# EAGLE design cherry-u2f (EAGLE 8.3.0)
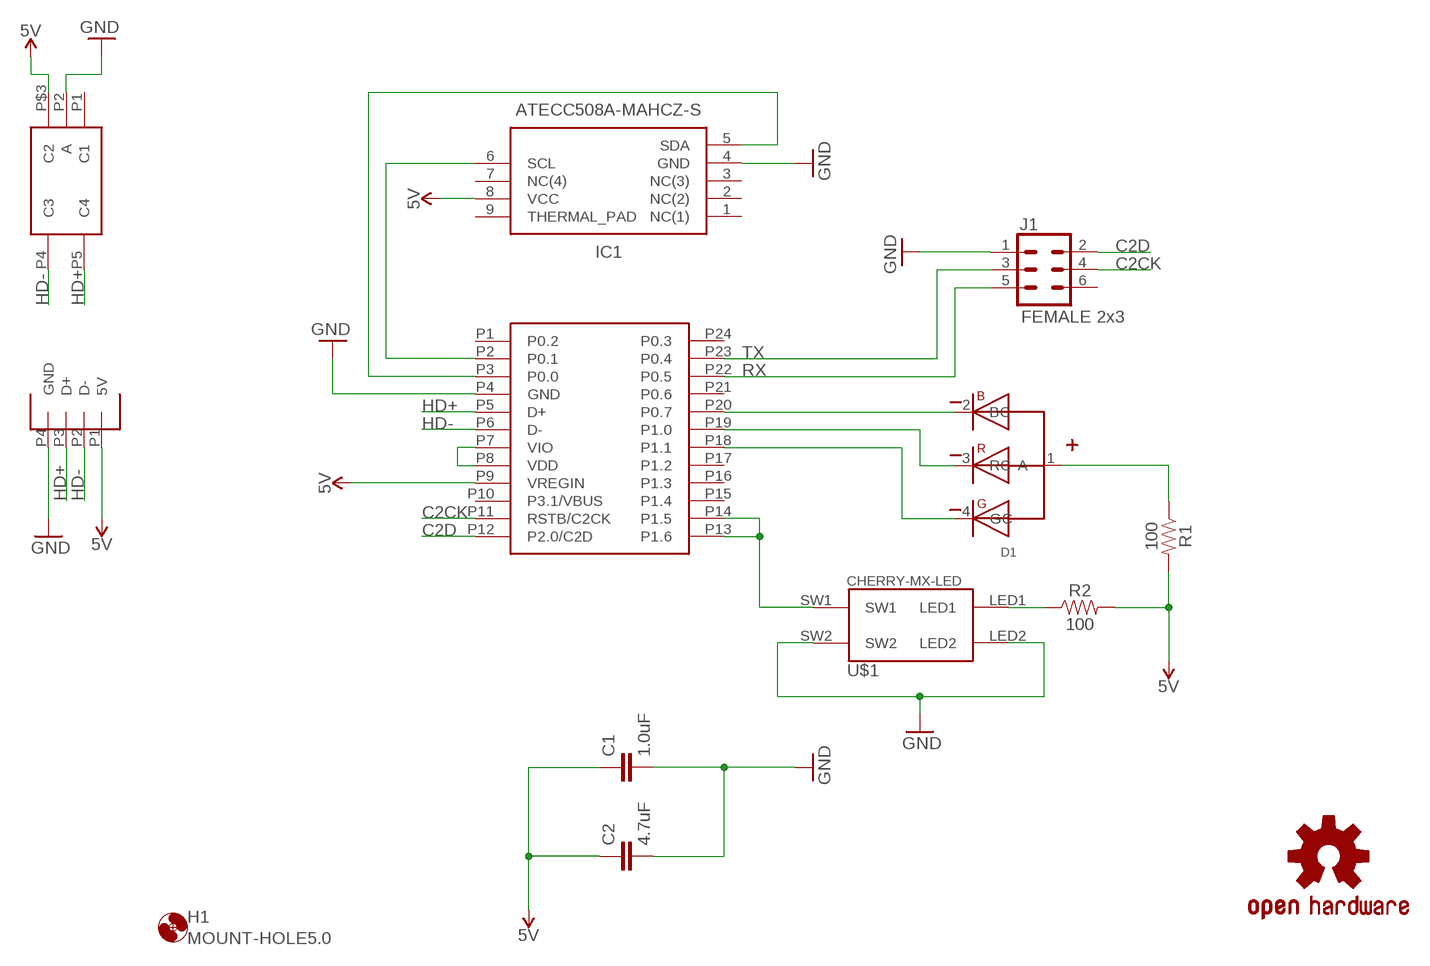
[diagram p0: schematic, sheet 1]

## Parts
C1  1.0uF  1.0UF-0603-16V-10%  [0603]
C2  4.7uF  4.7UF0603  [0603]
D1  WL-SFTW-150141M173100-R&G&B  [WL-SFTW_3528]
H1  MOUNT-HOLE5.0  [5,0]
IC1  ATECC508A-MAHCZ-S  [SON50P300X200X60-9N]
J1  FEMALE 2x3  CONN_03X2FEMALE  [2X3]
LOGO1  OSHW-LOGOS  [OSHW-LOGO-S]
R1  100  100OHM-0603-1/4W-5%  [0603]
R2  100  100OHM-0603-1/4W-5%  [0603]
U$1  CHERRY-MX-LED  [CHERRY-MX-LED]
U$2  EFM8UB1-QSOP24  [QSOP24]
U$3  DF5A5.6JE  [DF5A5.6JE]
U$4  USB-A-PCB  [USB-A-PCB]

## Nets
5V: C1.1 C2.1 IC1.8(VCC) R1.2 R2.2 U$2.P9(VREGIN) U$3.P$3(C2) U$4.P1(5V)
C2CK: J1.4 U$2.P11(RSTB/C2CK)
C2D: J1.2 U$2.P12(P2.0/C2D)
GND: C1.2 C2.2 IC1.4(GND) J1.1 U$1.LED2 U$1.SW2 U$2.P4(GND) U$3.P2(A) U$4.P4(GND)
HD+: U$2.P5(D+) U$3.P5(C4) U$4.P3(D+)
HD-: U$2.P6(D-) U$3.P4(C3) U$4.P2(D-)
N$1: U$1.SW1 U$2.P13(P1.6) U$2.P14(P1.5)
N$2: U$2.P7(VIO) U$2.P8(VDD)
N$3: R2.1 U$1.LED1
N$4: D1.3(RC) U$2.P19(P1.0)
N$5: D1.1(A) R1.1
N$6: D1.2(BC) U$2.P20(P0.7)
N$7: D1.4(GC) U$2.P18(P1.1)
N$10: IC1.6(SCL) U$2.P2(P0.1)
N$11: IC1.5(SDA) U$2.P3(P0.0)
RX: J1.5 U$2.P22(P0.5)
TX: J1.3 U$2.P23(P0.4)
Unconnected: IC1.1(NC(1)) IC1.2(NC(2)) IC1.3(NC(3)) IC1.7(NC(4)) IC1.9(THERMAL_PAD) J1.6 U$2.P1(P0.2) U$2.P10(P3.1/VBUS) U$2.P15(P1.4) U$2.P16(P1.3) U$2.P17(P1.2) U$2.P21(P0.6) U$2.P24(P0.3) U$3.P1(C1)

## Library data of the parts
C1 = SparkFun-Capacitors:1.0UF: 1µF ceramic capacitors A capacitor is a passive two-terminal electrical component used to store electrical energy temporarily in an electric field.; PROD_ID: CAP-00868
C2 = SparkFun-Capacitors:4.7UF: 4.7µF ceramic capacitors A capacitor is a passive two-terminal electrical component used to store electrical energy temporarily in an electric field.; PROD_ID: CAP-08280
D1 = Wurth_Elektronik_Optoelectronics_rev17b:WL-SFTW: SMD full-color TOP LED Characteristics Low energy consumption High reliability Low current requirement Fast switching No UV/IR radiation High brightness RGB individual control Compact package outline Black surface Applications Flash light Switch indicators Equipments indicators Accent and decorative lighting Electronic signage Video displays Backlight for LCDs, PDAs and TVs Oven, microwave Street lighting Ideal for lateral coupling in light guides <http://katalog.we-online.de/media/images/eipal/WL-SFTW_pf2.jpg> Details see: http://katalog.we-online.de/en/led/WL-SFTW?m Updated 2015-04-10 2015 (C) Wurth Elektronik
H1 = holes:MOUNT-HOLE: MOUNTING HOLE with drill center marker
IC1 = ATECC508A-MAHCZ-S:ATECC508A-MAHCZ-S: Security ICs / Authentication ICs AWS IOT Provisioned ECC508A 10Kb - 8ld UDFN Generic SWI, 3K T&R <https://componentsearchengine.com/Images/1/ATECC508A-MAHCZ-S.jpg> Source: Datasheet <http://www.mouser.com/ds/2/268/Atmel-8923S-CryptoAuth-ATECC508A-Datasheet-Summary-1065793.pdf>; DESCRIPTION: Security ICs / Authentication ICs AWS IOT Provisioned ECC508A 10Kb - 8ld UDFN Generic SWI, 3K T&R; HEIGHT: 0.6mm; MANUFACTURER_NAME: Atmel; MANUFACTURER_PART_NUMBER: ATECC508A-MAHCZ-S; SUPPLIER_NAME: RS
J1 = SparkFun-Connectors:CONN_03X2: Multi connection point. Often used as Generic Header-pin footprint for 0.1 inch spaced/style header connections You can populate with any combo of single row headers, but if you'd like an exact match, check these: Header - 2x3 (Male, 0.1") <https://www.sparkfun.com/products/12807> (PRT-12807) Header - 2x3 (Female, 0.1") <https://www.sparkfun.com/products/13010> (PRT-13010) 2x3 Pin Shrouded Header <https://www.sparkfun.com/products/10877> (PRT-10877) On any of the 0.1 inch spaced packages, you can populate with these: Break Away Headers - Straight <https://www.sparkfun.com/products/116> (PRT-00116) Break Away Male Headers - Right Angle <https://www.sparkfun.com/products/553> (PRT-00553) Female Headers <https://www.sparkfun.com/products/115> (PRT-00115) Break Away Headers - Machine Pin <https://www.sparkfun.com/products/117> (PRT-00117) Break Away Female Headers - Swiss Machine Pin <https://www.sparkfun.com/products/743> (PRT-00743) Special note: the shrouded connector mates well with our 3x2 ribbon cables: Ribbon Crimp Connector - 6-pin (2x3, Female) <https://www.sparkfun.com/products/10651> (PRT-10651) Ribbon Cable - 6 wire (15ft) <https://www.sparkfun.com/products/10646> (PRT-10646); PROD_ID: CONN-11566
LOGO1 = SparkFun-Aesthetics:OSHW-LOGO: Open-Source Hardware (OSHW) Logo This logo indicates the piece of hardware it is found on incorporates a OSHW license and/or adheres to the definition of open source hardware found here: http://freedomdefined.org/OSHW
R1 R2 = SparkFun-Resistors:100OHM: 100Ω resistor A resistor is a passive two-terminal electrical component that implements electrical resistance as a circuit element. Resistors act to reduce current flow, and, at the same time, act to lower voltage levels within circuits. - Wikipedia; PROD_ID: RES-12438
U$1 = cherrymx:CHERRY-MX-LED: Cherry MX series keyswitch with LED
U$2 = silabs_fb:EFM8UB1-QSOP24
U$3 = DF5A5:DF5A5.6JE
U$4 = USB-PCB:USB-A-PCB

## Board
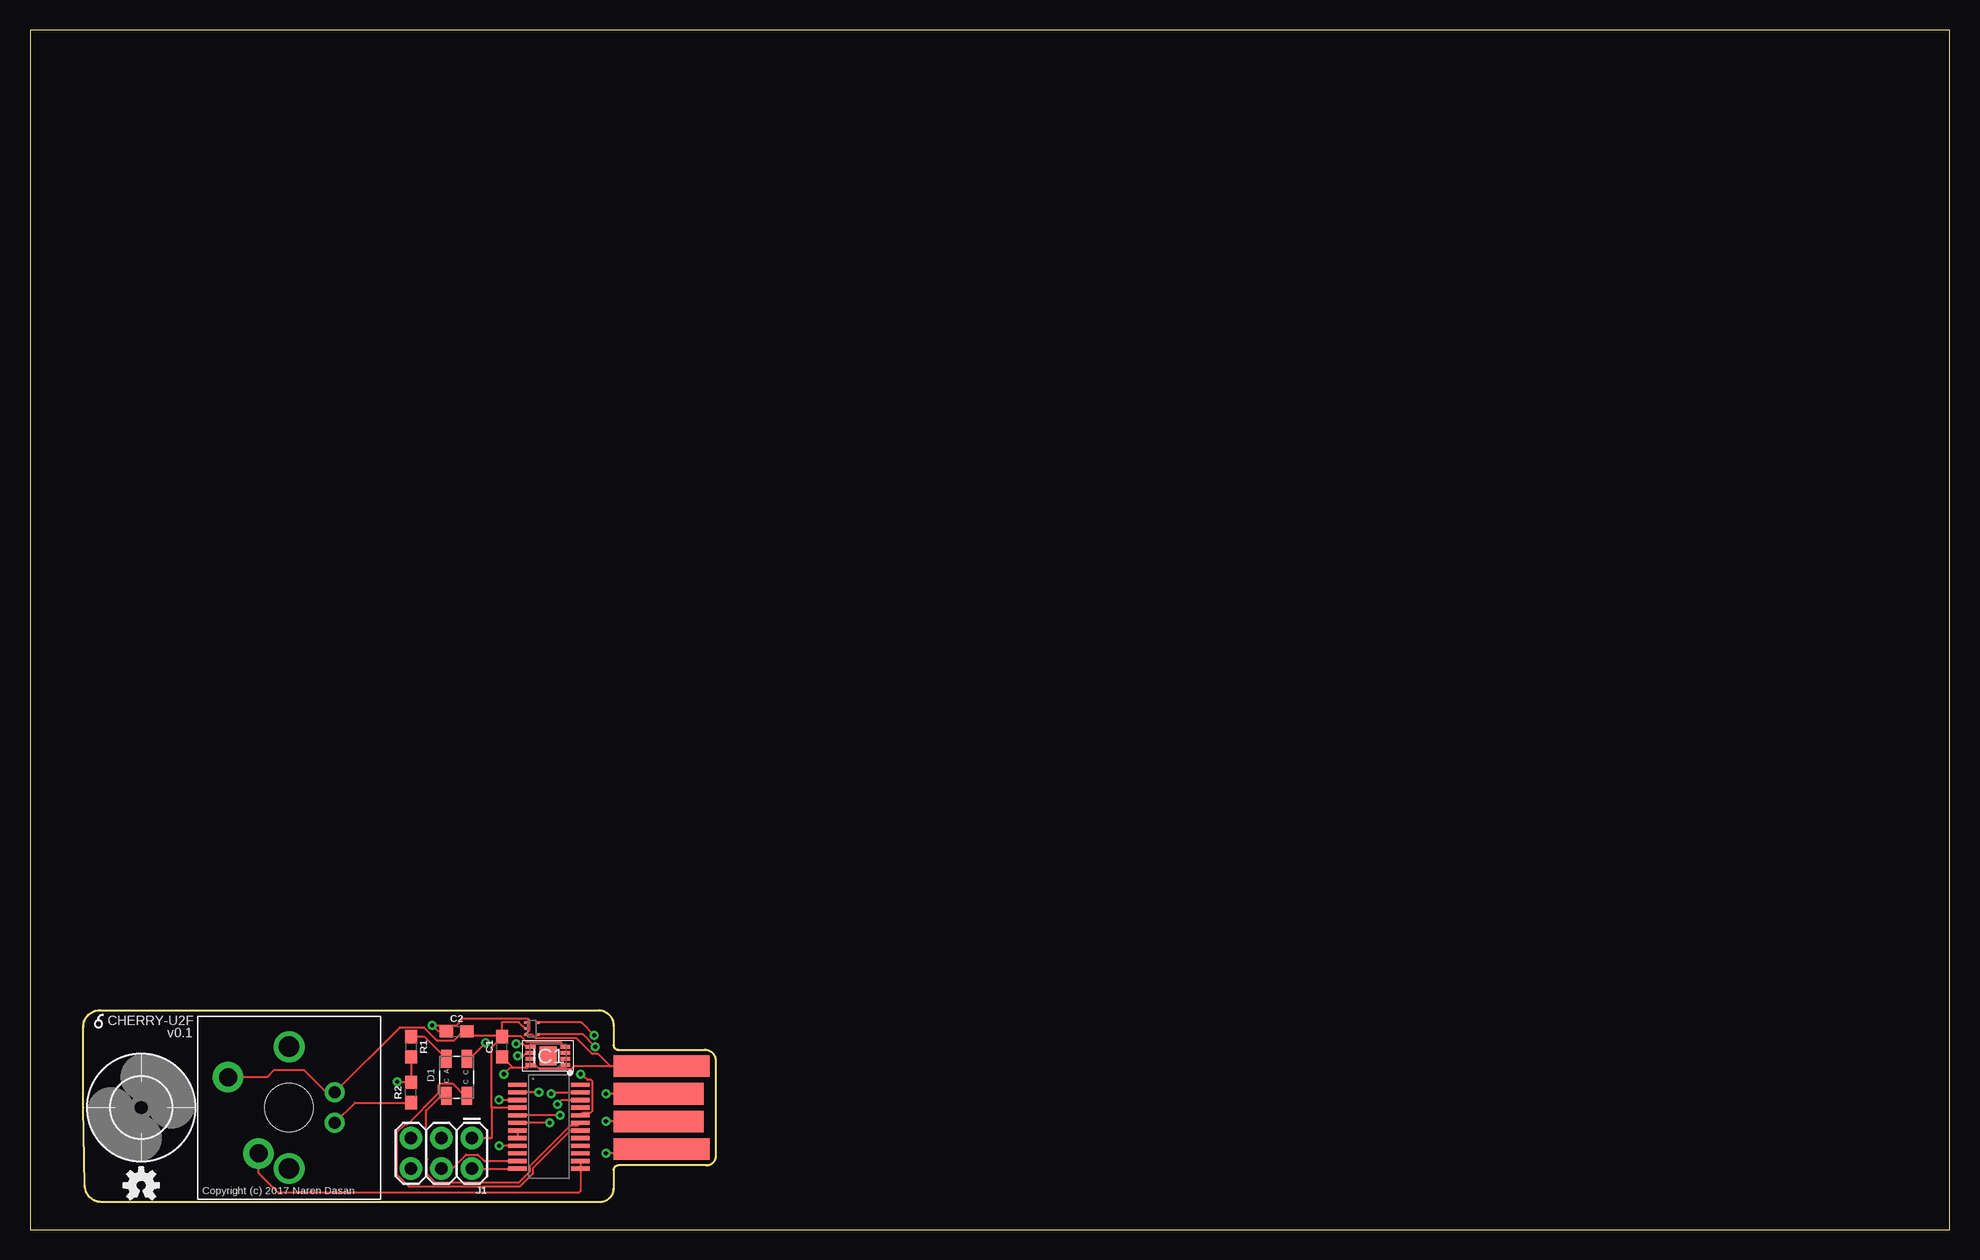
[diagram p1: board, top side]
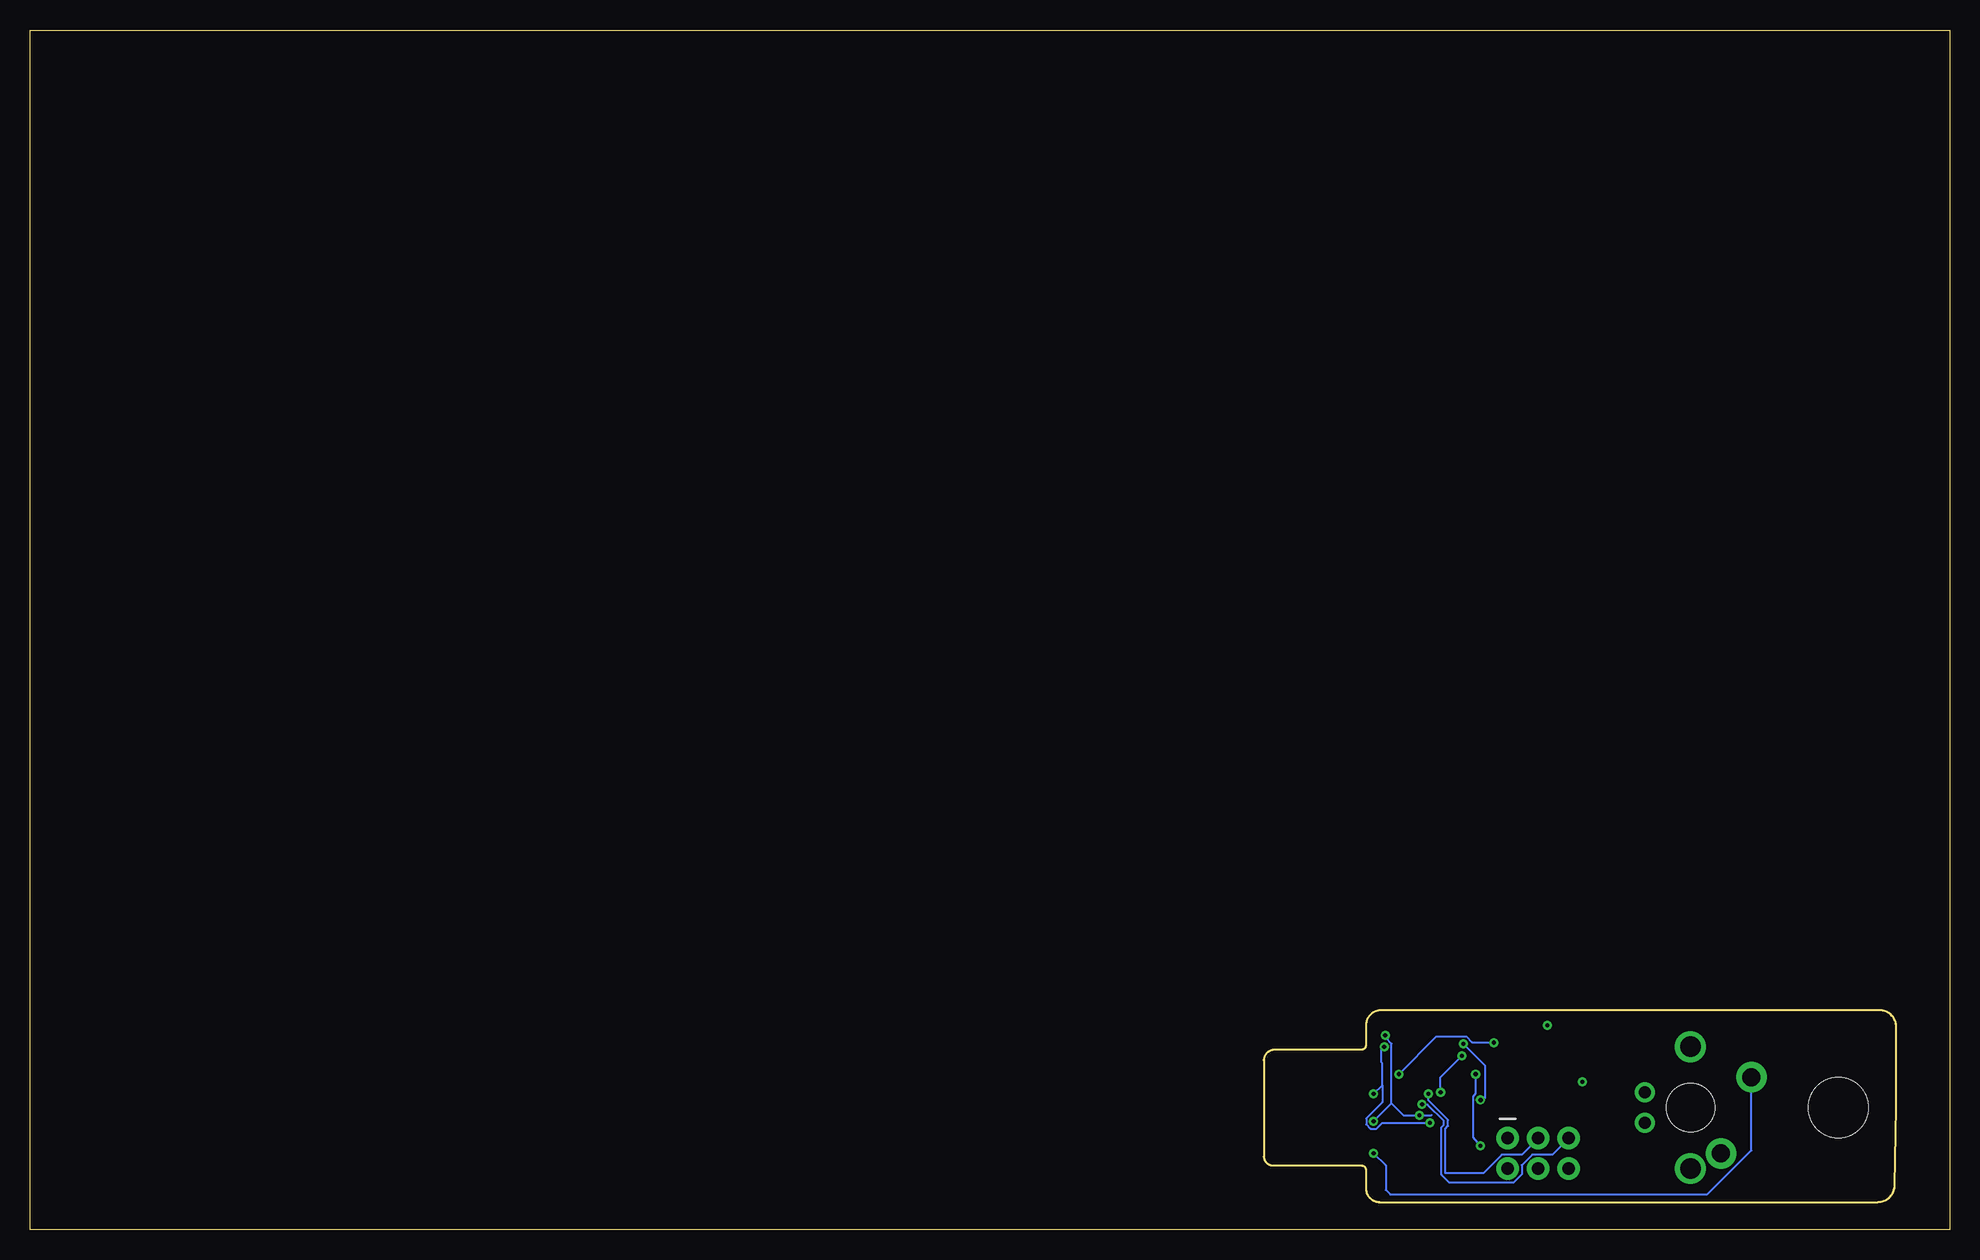
[diagram p2: board, bottom side, seen from below]

Size 160 x 100 mm. Coordinates in mm from the lower left corner, seen from the top.
Outline: 0,0 160,0 160,100 0,100 0,0
Copper layers (1*16): Top 0.035mm / dielectric 1.5mm / Bottom 0.035mm
Design rules "default": minimum track width 6mil, minimum drill 0.35mm, track to track 6mil, track to pad 6mil, pad to pad 6mil, via to via 6mil, smd to smd 6mil, copper to edge 40mil, drill to drill 6mil, minimum pad ring 10mil, minimum via ring 8mil, stop-mask expansion 4mil, vias tented up to drill 0mil, thermal gap 10mil

### Footprints (pad centres in the part's own frame; a part is rotated, then mirrored left to right if it is on the bottom)
0603 = smd 1.1 x 1: 1 -0.85,0; 2 0.85,0
WL-SFTW_3528 = smd 1.5 x 0.9: 1 1.55,0.85; 2 1.55,-0.85; 3 -1.55,0.85; 4 -1.55,-0.85
5,0 = hole 5: 0,0
SON50P300X200X60-9N = smd 0.8 x 0.3: 1 -1.45,0.75; 2 -1.45,0.25; 3 -1.45,-0.25; 4 -1.45,-0.75; 5 1.45,-0.75; 6 1.45,-0.25; 7 1.45,0.25; 8 1.45,0.75 | smd 1.4 x 1.6: 9 0,0
2X3 = drill 1.016 pad 1.88: 1 0,0; 2 0,2.54; 3 2.54,0; 4 2.54,2.54; 5 5.08,0; 6 5.08,2.54
CHERRY-MX-LED = drill 1.016 pad 1.676: LED1 -1.27,-3.81; LED2 1.27,-3.81 | drill 1.714 pad 1.93: P$3 -5.08,0; P$4 5.08,0 | drill 1.5 pad 2.54: SW1 -3.81,2.54; SW2 2.54,5.08 | hole 4: 0,0
QSOP24 = smd 1.55 x 0.35: P1 0,6.985; P2 0,6.35; P3 0,5.715; P4 0,5.08; P5 0,4.445; P6 0,3.81; P7 0,3.175; P8 0,2.54; P9 0,1.905; P10 0,1.27; P11 0,0.635; P12 0,0; P13 5.25,0; P14 5.25,0.635; P15 5.25,1.27; P16 5.25,1.905; P17 5.25,2.54; P18 5.25,3.175; P19 5.25,3.81; P20 5.25,4.445; P21 5.25,5.08; P22 5.25,5.715; P23 5.25,6.35; P24 5.25,6.985
DF5A5.6JE = smd 0.2 x 0.2: P1 0,1; P2 0,0.5; P4 1.1,0; P5 1.1,1; P$3 0,0
USB-A-PCB = smd 8 x 1.8: P1 4,7.9; P4 4,1 | smd 7.5 x 1.8: P2 3.75,5.6; P3 3.75,3.3

### Placement (x,y rotation side)
C1  39.37,15.24 90 top
C2  35.56,16.51 0 top
D1  35.56,12.7 90 top
H1  9.27,10.16 0 top
IC1  43.18,14.48 180 top
J1  36.83,7.62 180 top
LOGO1  9.27,3.68 0 top
R1  31.75,15.24 270 top
R2  31.75,11.43 90 top
U$1  21.59,10.16 90 top
U$2  40.64,5.08 0 top
U$3  41.27,16.26 0 top
U$4  48.64,5.71 0 top

### Tracks (layer width: path | path; a pad name or v marks a point on that pad's centre or on a via)
5V  (via drill 0.35)
  Top 0.152: R1.2 R2.2 30.65,12.28 v30.61,12.32 | C2.1 34.04,16.51 v33.53,17.02 35.55,17.02 36.11,17.59 41.47,17.59 41.6,17.45 41.6,16.56 41.47,16.43 41.45,16.43 U$3.P$3 41.85,16.26 42.18,15.93 45.57,15.93 46.87,14.63 47.34,14.63 48.39,13.59 | C1.1 39.37,14.35 40.26,13.46 | 40.26,13.46 41.46,13.46 IC1.8 42.11,13.73 42.48,13.35 45.12,13.35 45.36,13.59 48.39,13.59 | 40.26,13.46 40.01,13.46 v39.5,12.95 | U$2.P9 v39.12,6.99 | U$4.P1 52.62,13.59 48.39,13.59
  Bottom 0.152: v39.5,12.95 39.5,11.37 39.7,11.05 39.7,7.69 v39.12,6.99
  pour Bottom (isolate 1.27): 13.97,2.54 47.37,2.54 47.37,5.59 48.9,5.59 48.9,14.73 47.62,14.73 47.62,17.91 13.97,17.78
C2CK
  Top 0.152: J1.4 35.18,5.08 36.35,6.25 37.31,6.25 37.85,5.71 U$2.P11
C2D
  Top 0.152: J1.2 U$2.P12
GND  (via drill 0.35)
  Top 0.152: J1.1 38.48,7.62 38.48,10.16 | U$1.SW2 19.76,12.7 20.31,13.25 22.87,13.25 24.69,11.43 U$1.LED2 30.84,16.87 32.82,16.87 33.91,15.78 35.35,15.78 36.08,16.51 C2.2 36.74,16.18 39.37,16.18 | U$2.P4 38.48,10.16 | 38.48,10.16 38.48,15.2 C1.2 | U$4.P4 52.28,6.35 v48.01,6.35 | U$3.P2 41.1,16.93 41.08,16.93 40.74,17.27 39.37,17.27 39.37,16.18 | 39.37,16.18 C1.2 | IC1.4 44.23,15.62 41.38,15.62 40.92,16.09 C1.2
  Bottom 0.152: v48.01,6.35 46.99,5.33 46.99,3.3 46.61,2.92 20.19,2.92 16.51,6.6 U$1.SW2
  pour Top (isolate 1.27): 13.97,2.54 47.37,2.54 47.37,5.59 48.9,5.59 48.9,14.73 47.62,14.73 47.62,17.91 13.97,17.78
HD+  (via drill 0.35)
  Top 0.152: U$4.P3 v48.01,9.02 | v47.04,16.18 45.96,17.26 U$3.P5 | v44.2,9.53 U$2.P5
  Bottom 0.152: v48.01,9.02 46.51,10.51 | 46.51,10.51 46.51,15.49 46.99,15.97 46.99,16.26 47.04,16.21 v47.04,16.18 | 46.51,10.51 45.52,9.53 v44.2,9.53 43.18,9.53
HD-  (via drill 0.35)
  Top 0.152: U$4.P2 52.38,11.3 v48.01,11.3 | v47.12,15.24 46.1,16.26 U$3.P4 | v43.31,8.89 U$2.P6
  Bottom 0.152: v48.01,11.3 47.27,12.04 | 47.27,12.04 47.27,13.84 47.37,13.94 47.37,15.24 v47.12,15.24 | 47.27,12.04 47.27,10.61 48.61,9.27 48.61,8.77 48.26,8.41 47.76,8.41 47.27,8.89 v43.31,8.89
N$1
  Top 0.152: U$2.P14 U$2.P13 45.89,3.22 45.72,3.05 20.7,3.05 19.05,4.7 U$1.SW1
N$2
  Top 0.152: U$2.P7 U$2.P8
N$3
  Top 0.152: U$1.LED1 27.09,10.58 R2.1
N$4
  Top 0.152: U$2.P19 45.66,8.66 45.02,8.66 41.64,5.28 41.64,4.81 40.74,3.91 33.81,3.91 33.12,4.6 33.12,5.87 33.02,5.97 33.02,9.91 34.26,11.15 D1.3
N$5
  Top 0.152: R1.1 32.87,16.09 D1.1
N$6  (via drill 0.35)
  Top 0.152: U$2.P20 46.12,9.76 46.76,9.76 46.89,9.89 46.89,12.34 46.76,12.47 46.46,12.47 45.97,12.95 v45.9,12.95 | v37.97,15.58 36.65,14.25 D1.2
  Bottom 0.152: v45.9,12.95 42.77,16.09 40.26,16.09 39.79,15.62 37.97,15.62 v37.97,15.58
N$7
  Top 0.152: U$2.P18 45.05,8.26 41.95,5.16 41.95,4.68 40.87,3.61 31.57,3.61 30.58,4.6 30.58,8.1 31.27,8.79 31.47,8.79 34.03,11.35 34.03,11.99 34.16,12.13 35.26,12.13 36.23,11.15 D1.4
N$10  (via drill 0.35)
  Top 0.152: IC1.6 41.61,14.61 41.23,14.61 41.11,14.48 v40.64,14.48 | v42.42,11.43 U$2.P2
  Bottom 0.152: v40.64,14.48 42.42,12.7 v42.42,11.43
N$11  (via drill 0.35)
  Top 0.152: IC1.5 41.64,15.32 41.26,15.32 41.09,15.48 v40.51,15.48 | v39.09,10.79 U$2.P3
  Bottom 0.152: v40.51,15.48 38.73,13.71 38.73,10.92 38.86,10.79 v39.09,10.79
RX  (via drill 0.35)
  Top 0.152: v43.96,10.43 44.32,10.79 U$2.P22
  Bottom 0.152: J1.5 33.12,6.25 34.77,6.25 35.66,5.36 35.66,4.6 36.35,3.91 41.68,3.91 42.34,4.57 42.34,8.54 42.16,8.72 42.16,9.06 43.52,10.41 43.69,10.41 43.71,10.43 v43.96,10.43
TX  (via drill 0.35)
  Top 0.152: v43.43,11.3 43.56,11.43 U$2.P23
  Bottom 0.152: J1.3 35.66,6.25 37.31,6.25 38.86,4.7 42.04,4.7 42.04,8.41 41.81,8.64 41.81,9.14 43.43,10.76 v43.43,11.3 | v43.43,11.3 43.43,11.43 v43.43,11.3

### Text on the board
tPlace: CHERRY-U2F | v0.1 | Copyright (c) 2017 Naren Dasan